# EAGLE design AVR_Tag-Connect (EAGLE 7.4.0)
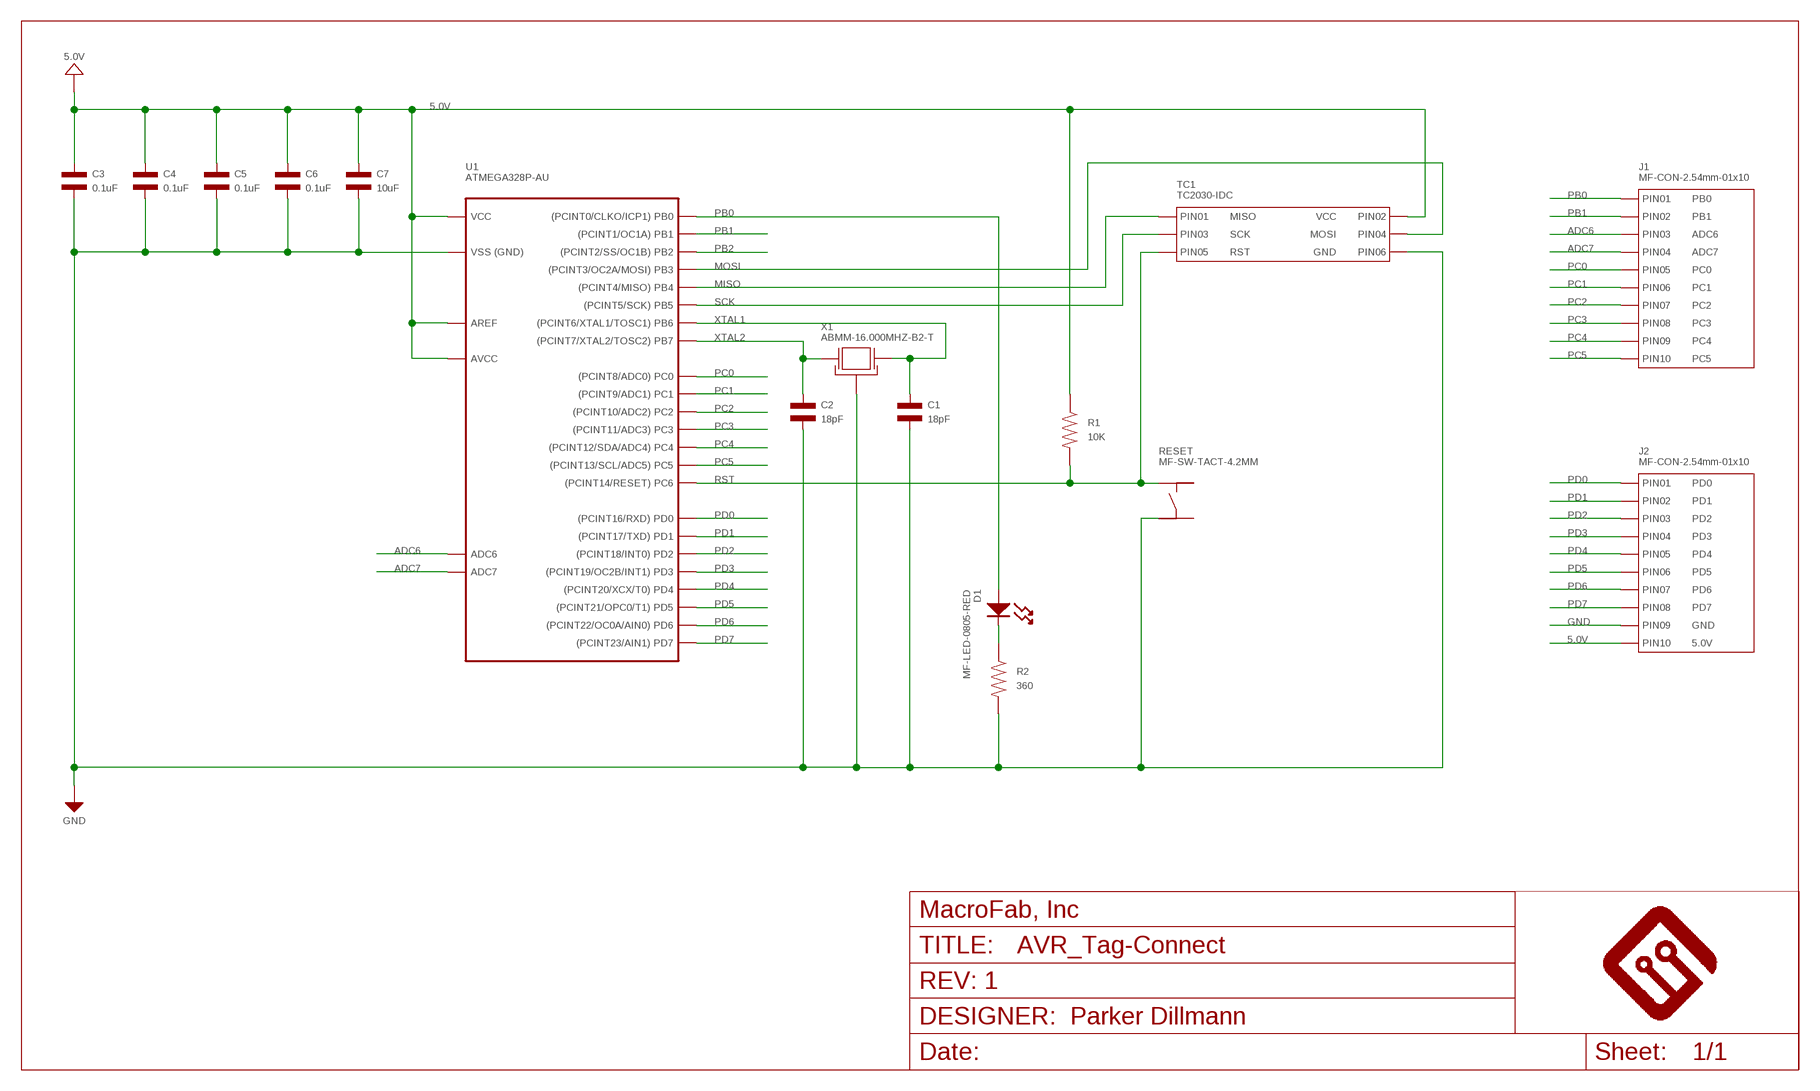
[diagram p0: schematic, sheet 1]

## Parts
C1  18pF  CAPACITOR_NP_0805  [C0805]
C2  18pF  CAPACITOR_NP_0805  [C0805]
C3  0.1uF  CAPACITOR_NP_0805  [C0805]
C4  0.1uF  CAPACITOR_NP_0805  [C0805]
C5  0.1uF  CAPACITOR_NP_0805  [C0805]
C6  0.1uF  CAPACITOR_NP_0805  [C0805]
C7  10uF  CAPACITOR_NP_1206  [C1206]
D1  MF-LED-0805-RED  LED_SINGLE-0805-RED  [LED0805]
FRAME1  MF_FRAMEDEFAULT  [MF_FRAME_DEFAULT]
J1  MF-CON-2.54mm-01x10  CON_01X10_PTH_2.54MM  [PTH_2.54MM_01X10]
J2  MF-CON-2.54mm-01x10  CON_01X10_PTH_2.54MM  [PTH_2.54MM_01X10]
R1  10K  RESISTOR_0805  [R0805]
R2  360  RESISTOR_0805  [R0805]
RESET  MF-SW-TACT-4.2MM  TACT_4.2MM  [TACT4.2MM]
TC1  TC2030-IDC  CON_02X03_AVRISP_TC2030-IDC  [TC2030-IDC-FP]
U1  ATMEGA328P-AU  [TQFP32]
X1  ABMM-16.000MHZ-B2-T  CYRSTAL_GND_ABMM  [7MMX5MM]

## Nets
5.0V: C3.P$1 C4.P$1 C5.P$1 C6.P$1 C7.P$1 J2.P$10(PIN10) R1.P$1 TC1.P$2(PIN2) U1.P$4(VCC) U1.P$6(VCC) U1.P$18(AVCC) U1.P$20(AREF)
ADC6: J1.P$3(PIN3) U1.P$19(ADC6)
ADC7: J1.P$4(PIN4) U1.P$22(ADC7)
GND: C1.P$2 C2.P$2 C3.P$2 C4.P$2 C5.P$2 C6.P$2 C7.P$2 J2.P$9(PIN9) R2.P$2 RESET.P$3 TC1.P$6(PIN6) U1.P$3(GND) U1.P$5(GND) U1.P$21(GND) X1.P$2(GND) X1.P$4(GND)
MISO: TC1.P$1(PIN1) U1.P$16(PB4)
MOSI: TC1.P$4(PIN4) U1.P$15(PB3)
N$2: D1.CATHODE R2.P$1
PB0: D1.ANODE J1.P$1(PIN1) U1.P$12(PB0)
PB1: J1.P$2(PIN2) U1.P$13(PB1)
PB2: U1.P$14(PB2)
PC0: J1.P$5(PIN5) U1.P$23(PC0)
PC1: J1.P$6(PIN6) U1.P$24(PC1)
PC2: J1.P$7(PIN7) U1.P$25(PC2)
PC3: J1.P$8(PIN8) U1.P$26(PC3)
PC4: J1.P$9(PIN9) U1.P$27(PC4)
PC5: J1.P$10(PIN10) U1.P$28(PC5)
PD0: J2.P$1(PIN1) U1.P$30(PD0)
PD1: J2.P$2(PIN2) U1.P$31(PD1)
PD2: J2.P$3(PIN3) U1.P$32(PD2)
PD3: J2.P$4(PIN4) U1.P$1(PD3)
PD4: J2.P$5(PIN5) U1.P$2(PD4)
PD5: J2.P$6(PIN6) U1.P$9(PD5)
PD6: J2.P$7(PIN7) U1.P$10(PD6)
PD7: J2.P$8(PIN8) U1.P$11(PD7)
RST: R1.P$2 RESET.P$1 TC1.P$5(PIN5) U1.P$29(PC6)
SCK: TC1.P$3(PIN3) U1.P$17(PB5)
XTAL1: C1.P$1 U1.P$7(PB6) X1.P$3(X1)
XTAL2: C2.P$1 U1.P$8(PB7) X1.P$1(X0)
Unconnected: RESET.P$2 RESET.P$4

## Library data of the parts
C1 C2 = MF_Passives:CAPACITOR_NP: Library: MF_Passives Description: Device for Non-Polarized Capacitors. Manufacture part number (MPN) can be added via Attributes. Check https://factory.macrofab.com/parts for the house parts list.; MPN: 08055A180JAT2A; POPULATE: 1
C3-C6 = MF_Passives:CAPACITOR_NP: Library: MF_Passives Description: Device for Non-Polarized Capacitors. Manufacture part number (MPN) can be added via Attributes. Check https://factory.macrofab.com/parts for the house parts list.; MPN: MF-CAP-0805-0.1uF; POPULATE: 1
C7 = MF_Passives:CAPACITOR_NP: Library: MF_Passives Description: Device for Non-Polarized Capacitors. Manufacture part number (MPN) can be added via Attributes. Check https://factory.macrofab.com/parts for the house parts list.; MPN: MF-CAP-1206-10uF; POPULATE: 1
D1 = MF_LEDs:LED_SINGLE: Library: MF_LEDs Description: Device for Single LED Packages. Manufacture part number (MFG#) can be added via Attributes.; HOUSEPART: YES; MPN: MF-LED-0805-RED; POPULATE: 1; URL: https://factory.macrofab.com/part/MF-LED-0805-RED
FRAME1 = MF_Aesthetics:MF_FRAME: Library: MF_Aesthetics Description: Frame for adding Meta Data to the PCB and Schematic.; DNAME: Parker Dillmann; HOUSEPART: 0; POPULATE: 0; REVNUM: REV: 1
J1 = MF_Connectors:CON_01X10: Library: MF_Connectors Description: Header Connector with 10 Positions and 01 Rows. Use the LABEL Attribute to label the pin on the schematic and PCB. You can remove the attributes on the PCB by using the SMASH function on the part and then deleting the text.; HOUSEPART: YES; LABEL01: PB0; LABEL02: PB1; LABEL03: ADC6; LABEL04: ADC7; LABEL05: PC0; LABEL06: PC1; LABEL07: PC2; LABEL08: PC3; LABEL09: PC4; LABEL10: PC5; MPN: MF-CON-2.54mm-01x10; POPULATE: 1; URL: https://factory.macrofab.com/part/MF-CON-2.54mm-01x10
J2 = MF_Connectors:CON_01X10: Library: MF_Connectors Description: Header Connector with 10 Positions and 01 Rows. Use the LABEL Attribute to label the pin on the schematic and PCB. You can remove the attributes on the PCB by using the SMASH function on the part and then deleting the text.; HOUSEPART: YES; LABEL01: PD0; LABEL02: PD1; LABEL03: PD2; LABEL04: PD3; LABEL05: PD4; LABEL06: PD5; LABEL07: PD6; LABEL08: PD7; LABEL09: GND; LABEL10: 5.0V; MPN: MF-CON-2.54mm-01x10; POPULATE: 1; URL: https://factory.macrofab.com/part/MF-CON-2.54mm-01x10
R1 = MF_Passives:RESISTOR: Library: MF_Passives Description: Device for Resistors. Manufacture part number (MPN), Voltage, Tolerance, and Wattage Rating can be added via Attributes. Check https://factory.macrofab.com/parts for the house parts list.; MPN: MF-RES-0805-10K; POPULATE: 1
R2 = MF_Passives:RESISTOR: Library: MF_Passives Description: Device for Resistors. Manufacture part number (MPN), Voltage, Tolerance, and Wattage Rating can be added via Attributes. Check https://factory.macrofab.com/parts for the house parts list.; MPN: MF-RES-0805-360; POPULATE: 1
RESET = MF_Switches:TACT: Library: MF_Switches Description: Device for Tact Switches. Manufacture part number (MFG#) can be added via Attributes.; HOUSEPART: YES; MPN: MF-SW-TACT-4.2MM; POPULATE: 1; URL: https://factory.macrofab.com/part/MF-SW-TACT-4.2MM
TC1 = MF_Connectors:CON_02X03: Library: MF_Connectors Description: Header Connector with 6 Positions and 02 Rows. Use the LABEL Attribute to label the pin on the schematic and PCB. You can remove the attributes on the PCB by using the SMASH function on the part and then deleting the text.; HOUSEPART: NO; LABEL01: MISO; LABEL02: VCC; LABEL03: SCK; LABEL04: MOSI; LABEL05: RST; LABEL06: GND; MPN: TC2030-IDC; POPULATE: 0; URL: http://www.tag-connect.com/AVRISP
U1 = MF_IC_Digital:ATMEGA328P: Manufacturer Part #: ATMEGA328P Manufacturer: Atmel Description: 8-bit Microcontrollers - MCU 32KB In-system Flash 20MHz 1.8V-5.5V; HOUSEPART: NO; MPN: ATMEGA328P-AU; POPULATE: 1; URL: http://www.atmel.com/devices/atmega328p.aspx
X1 = MF_Frequency_Control:CYRSTAL_GND: Library: MF_Frequency_Control Description: Device for two functional pin Cyrstal Oscillators and a ground.; HOUSEPART: NO; MPN: ABMM-16.000MHZ-B2-T; POPULATE: 1; URL: http://www.abracon.com/Resonators/ABMM.pdf

## Board
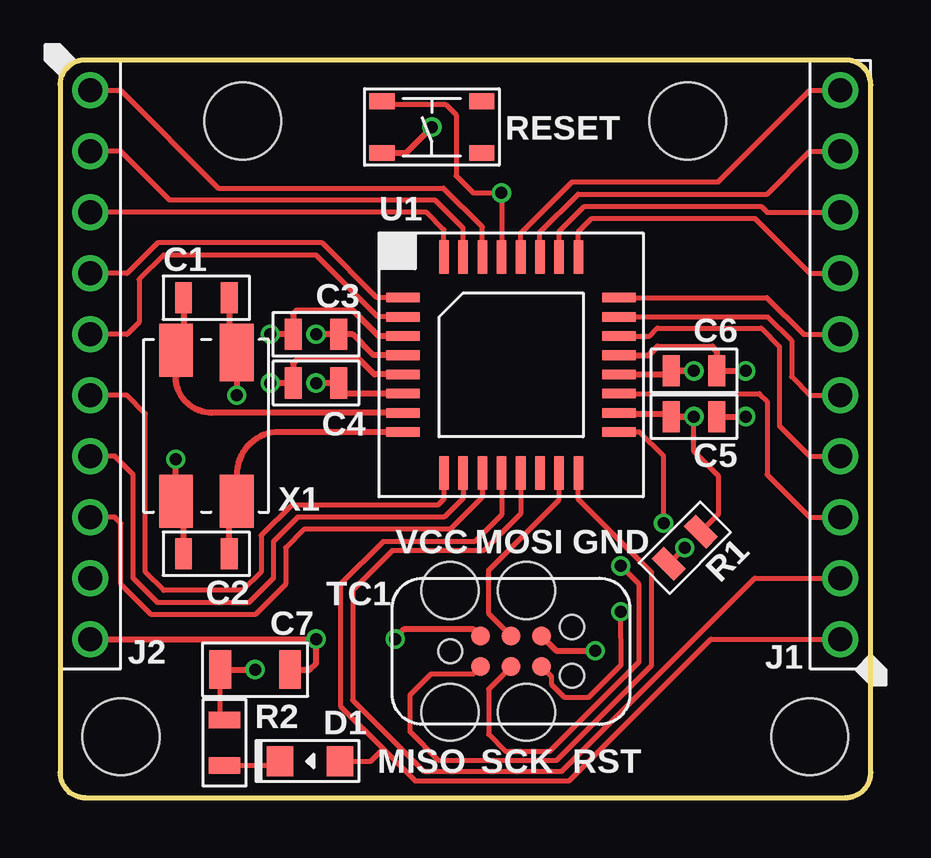
[diagram p1: board, top side]
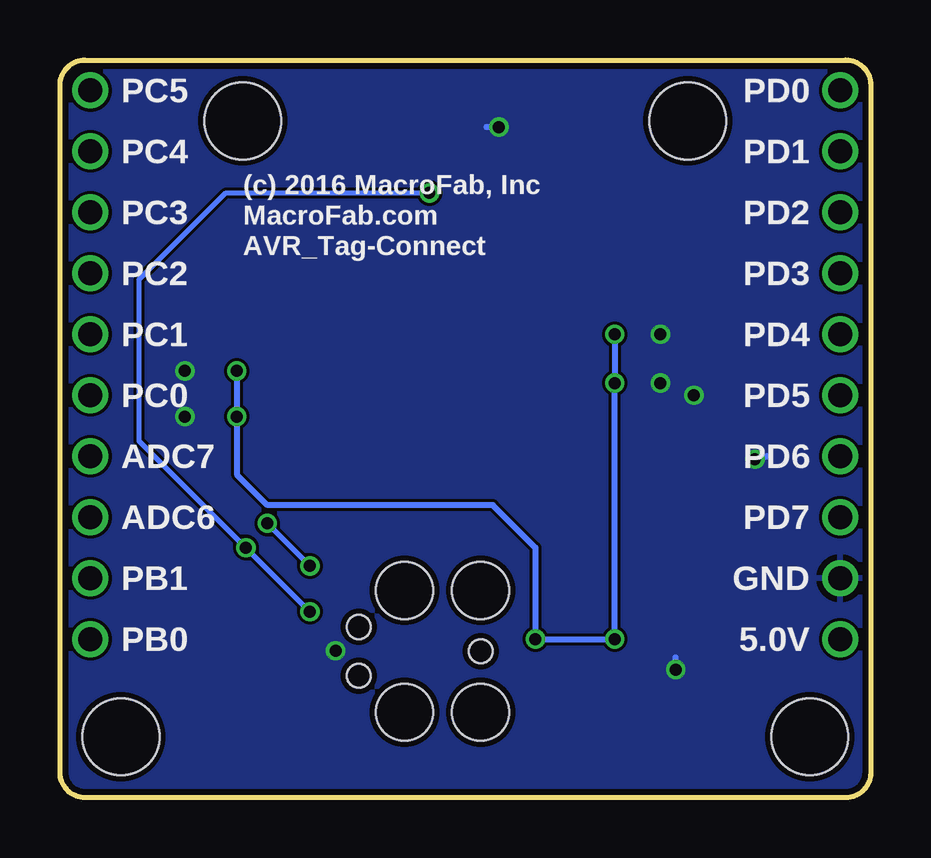
[diagram p2: board, bottom side, seen from below]

Size 33.78 x 30.73 mm. Coordinates in mm from the lower left corner, seen from the top.
Outline: 0,29.69 0,1.05 arc90 1.05,0 32.73,0 arc90 33.78,1.05 33.78,29.69 arc90 32.73,30.73 1.05,30.73 arc90 0,29.69
Copper layers (1*16): Top 0.035mm / dielectric 1.5mm / Bottom 0.035mm
Design rules "MF_Standard_2_Layer": minimum track width 5mil, minimum drill 12mil, track to track 5mil, track to pad 5mil, pad to pad 5mil, via to via 5mil, smd to smd 0mil, copper to edge 10mil, drill to drill 10mil, minimum pad ring 6mil, minimum via ring 6mil, stop-mask expansion 2mil, vias tented up to drill 25mil, thermal gap 10mil
Holes 3.2 mm at 7.62,28.19 26.16,28.19 2.54,2.54 31.24,2.54

### Footprints (pad centres in the part's own frame; a part is rotated, then mirrored left to right if it is on the bottom)
C0805 = smd 0.7 x 1.3: P$1 -0.95,0; P$2 0.95,0
C1206 = smd 0.9 x 1.6: P$1 -1.45,0; P$2 1.45,0
LED0805 = smd 1.1 x 1.25: ANODE 1.25,0; CATHODE -1.25,0
PTH_2.54MM_01X10 = drill 1: P$1 -11.43,0; P$2 -8.89,0; P$3 -6.35,0; P$4 -3.81,0; P$5 -1.27,0; P$6 1.27,0; P$7 3.81,0; P$8 6.35,0; P$9 8.89,0; P$10 11.43,0
R0805 = smd 0.7 x 1.3: P$1 -0.95,0; P$2 0.95,0
TACT4.2MM = smd 1.05 x 0.65: P$1 -2.075,1.075; P$2 2.075,1.075; P$3 -2.075,-1.075; P$4 2.075,-1.075
TC2030-IDC-FP = smd 0.787 x 0.787: P$1 -1.27,-0.635; P$2 -1.27,0.635; P$3 0,-0.635; P$4 0,0.635; P$5 1.27,-0.635; P$6 1.27,0.635 | hole 0.991: 2.54,1.016; 2.54,-1.016; -2.54,0 | hole 2.375: -2.54,2.54; 0.635,2.54; 0.635,-2.54; -2.54,-2.54
TQFP32 = smd 1.4 x 0.4: P$1 -4.5,2.8; P$2 -4.5,2; P$3 -4.5,1.2; P$4 -4.5,0.4; P$5 -4.5,-0.4; P$6 -4.5,-1.2; P$7 -4.5,-2; P$8 -4.5,-2.8; P$17 4.5,-2.8; P$18 4.5,-2; P$19 4.5,-1.2; P$20 4.5,-0.4; P$21 4.5,0.4; P$22 4.5,1.2; P$23 4.5,2; P$24 4.5,2.8 | smd 0.4 x 1.4: P$9 -2.8,-4.5; P$10 -2,-4.5; P$11 -1.2,-4.5; P$12 -0.4,-4.5; P$13 0.4,-4.5; P$14 1.2,-4.5; P$15 2,-4.5; P$16 2.8,-4.5; P$25 2.8,4.5; P$26 2,4.5; P$27 1.2,4.5; P$28 0.4,4.5; P$29 -0.4,4.5; P$30 -1.2,4.5; P$31 -2,4.5; P$32 -2.8,4.5
7MMX5MM = smd 1.4 x 2.2: P$1 -1.27,3.15; P$2 1.27,3.15; P$3 1.27,-3.15 | smd 1.4 x 2.4: P$4 -1.27,-3.05

### Placement (x,y rotation side)
C1  6.1,20.83 0 top
C2  6.1,10.16 180 top
C3  10.67,19.3 180 top
C4  10.67,17.27 180 top
C5  26.42,15.88 0 top
C6  26.42,17.78 0 top
C7  8.13,5.33 180 top
D1  10.41,1.52 0 top
FRAME1  26.16,26.42 0 bottom
J1  32.51,18.03 90 top
J2  1.27,18.03 270 top
R1  26.04,10.41 225 top
R2  6.86,2.29 90 top
RESET  15.49,27.94 0 top
TC1  18.8,6.1 0 top
U1  18.8,18.03 0 top
X1  6.1,15.49 180 top

### Tracks (layer width: path | path; a pad name or v marks a point on that pad's centre or on a via)
5.0V  (via drill 0.5)
  Top 0.203: v26.42,15.88 26.42,14.43 27.43,13.41 27.43,11.81 R1.P$1
  Top 0.254: 25.4,16 25.47,16 C5.P$1 v26.42,15.88 25.53,15.88 25.4,16 | TC1.P$2 17.25,7.01 14.33,7.01 13.92,6.6 v13.97,6.6 | 11.43,17.27 C4.P$1 11.62,16.83 U1.P$6 11.87,16.83 11.43,17.27 | 11.43,17.27 v10.67,17.27 | U1.P$4 13.06,18.43 12.19,19.3 C3.P$1 v10.67,19.3 | J2.P$10 v10.67,6.6 10.67,5.59 10.41,5.33 C7.P$1 | U1.P$18 23.33,16 25.4,16 | U1.P$20 25.47,17.63 C6.P$1 v26.42,17.78 25.4,17.78 25.4,17.63 U1.P$20
  Bottom 0.254: v10.67,19.3 v10.67,17.27 v10.67,6.6 v13.97,6.6 13.97,10.41 15.75,12.19 25.15,12.19 26.42,13.46 v26.42,15.88 v26.42,17.78
ADC6
  Top 0.203: U1.P$19 29.14,16.83 29.46,16.51 29.46,13.46 31.24,11.68 J1.P$3
ADC7
  Top 0.203: U1.P$22 24.57,19.23 24.89,19.56 29.21,19.56 29.97,18.8 29.97,15.49 31.24,14.22 J1.P$4
GND  (via drill 0.5)
  Top 0.203: R2.P$2 6.68,3.42 C7.P$2
  Top 0.254: C2.P$2 5.15,12.02 X1.P$2 v4.83,14.1 | C1.P$2 7.05,18.86 X1.P$4 v7.37,16.76 | U1.P$5 13.1,17.63 12.45,18.29 9.91,18.29 9.72,18.1 C4.P$2 v8.76,17.27 | U1.P$3 13.28,19.23 12.22,20.3 9.86,20.3 9.72,20.16 C3.P$2 v8.76,19.3 | U1.P$21 24.53,18.43 24.89,18.8 27.18,18.8 27.37,18.61 C6.P$2 v28.57,17.78 | C5.P$2 v28.57,15.88 | TC1.P$6 20.68,6.12 v22.3,6.12 | RESET.P$3 14.42,26.86 v15.49,27.94 | C7.P$2 v8.13,5.33
  Bottom 0.254: v4.83,14.1 4.32,14.22 | v7.37,16.76 7.11,16.76 | v15.49,27.94 16,27.94 | v8.13,5.33 8.13,5.84
  pour Bottom: 0,0 0,30.99 33.78,30.99 33.78,0
MISO
  Top 0.203: U1.P$16 21.6,12.44 24.64,9.4 24.64,5.5 20.68,1.54 15.79,1.54 14.59,2.74 14.59,4.28 15.46,5.16 17.22,5.16 TC1.P$1
MOSI
  Top 0.203: U1.P$15 20.8,12.41 17.84,9.46 17.84,7.68 TC1.P$4
N$2
  Top 0.203: D1.CATHODE 8.98,1.34 R2.P$1
PB0
  Top 0.203: U1.P$12 18.4,11.79 17.27,10.67 13.46,10.67 11.68,8.89 11.68,3.81 13.46,2.03 | 13.46,2.03 14.79,0.7 21.22,0.7 27.12,6.6 J1.P$1 | D1.ANODE 12.95,1.52 13.46,2.03
PB1
  Top 0.203: U1.P$13 19.2,11.83 17.65,10.29 13.84,10.29 12.19,8.64 12.19,4.06 15.15,1.1 20.91,1.1 28.95,9.14 J1.P$2
PC0
  Top 0.203: U1.P$23 29.5,20.03 30.48,19.05 30.48,17.53 31.24,16.76 J1.P$5
PC1
  Top 0.203: U1.P$24 29.46,20.83 30.99,19.3 J1.P$6
PC2
  Top 0.203: U1.P$25 21.6,23.57 22.16,24.13 28.96,24.13 31.24,21.84 J1.P$7
PC3
  Top 0.203: U1.P$26 20.8,23.59 21.84,24.64 29.21,24.64 29.46,24.38 J1.P$8
PC4
  Top 0.203: U1.P$27 20,23.55 21.59,25.15 29.46,25.15 31.24,26.92 J1.P$9
PC5
  Top 0.203: U1.P$28 19.2,23.51 21.34,25.65 27.43,25.65 31.24,29.46 J1.P$10
PD0
  Top 0.203: U1.P$30 17.6,23.78 15.98,25.4 6.6,25.4 2.54,29.46 J2.P$1
PD1
  Top 0.203: U1.P$31 16.8,23.73 15.63,24.89 4.57,24.89 2.54,26.92 J2.P$2
PD2
  Top 0.203: U1.P$32 16,23.67 15.28,24.38 J2.P$3
PD3
  Top 0.203: U1.P$1 13.2,20.83 10.92,23.11 4.06,23.11 2.79,21.84 J2.P$4
PD4
  Top 0.203: U1.P$2 13.24,20.03 10.67,22.61 4.32,22.61 3.3,21.59 3.3,19.81 2.79,19.3 J2.P$5
PD5
  Top 0.203: U1.P$9 16,12.44 15.75,12.19 9.65,12.19 8.38,10.92 8.38,9.4 7.62,8.64 4.32,8.64 3.56,9.4 3.56,16 2.79,16.76 J2.P$6
PD6
  Top 0.203: U1.P$10 16.8,12.48 16,11.68 9.91,11.68 8.89,10.67 8.89,9.14 7.87,8.13 4.06,8.13 3.05,9.14 3.05,13.46 2.29,14.22 J2.P$7
PD7
  Top 0.203: U1.P$11 17.6,12.52 16.26,11.18 10.16,11.18 9.4,10.41 9.4,8.89 8.13,7.62 3.81,7.62 2.54,8.89 2.54,11.43 2.29,11.68 J2.P$8
RST  (via drill 0.5)
  Top 0.203: TC1.P$5 20.47,5.05 20.47,4.72 21.01,4.18 22.04,4.19 23.38,5.53 v23.37,7.75 | U1.P$29 v18.4,25.19 v18.39,25.2 17.22,25.2 16.51,25.91 16.51,28.45 16.07,28.89 13.29,28.89 RESET.P$1 | v26.04,10.41 R1.P$2
  Bottom 0.203: v18.39,25.2 26.87,25.2 30.48,21.59 30.48,14.86 v26.04,10.41 v23.37,7.75
SCK  (via drill 0.5)
  Top 0.203: TC1.P$3 17.86,4.52 17.86,2.63 18.55,1.94 20.42,1.94 24.13,5.66 24.13,8.89 v23.37,9.65 | v25.15,11.43 25.15,14.22 24.14,15.23 U1.P$17
  Bottom 0.203: v23.37,9.65 v25.15,11.43
XTAL1
  Top 0.254: C1.P$1 5.15,18.96 X1.P$3 4.83,17.53 arc90 6.32,16.03 U1.P$7
XTAL2
  Top 0.254: C2.P$1 7.05,12.02 X1.P$1 7.37,13.46 arc-90 9.14,15.23 U1.P$8